# EAGLE schematic Bv Switch (EAGLE 6.2)
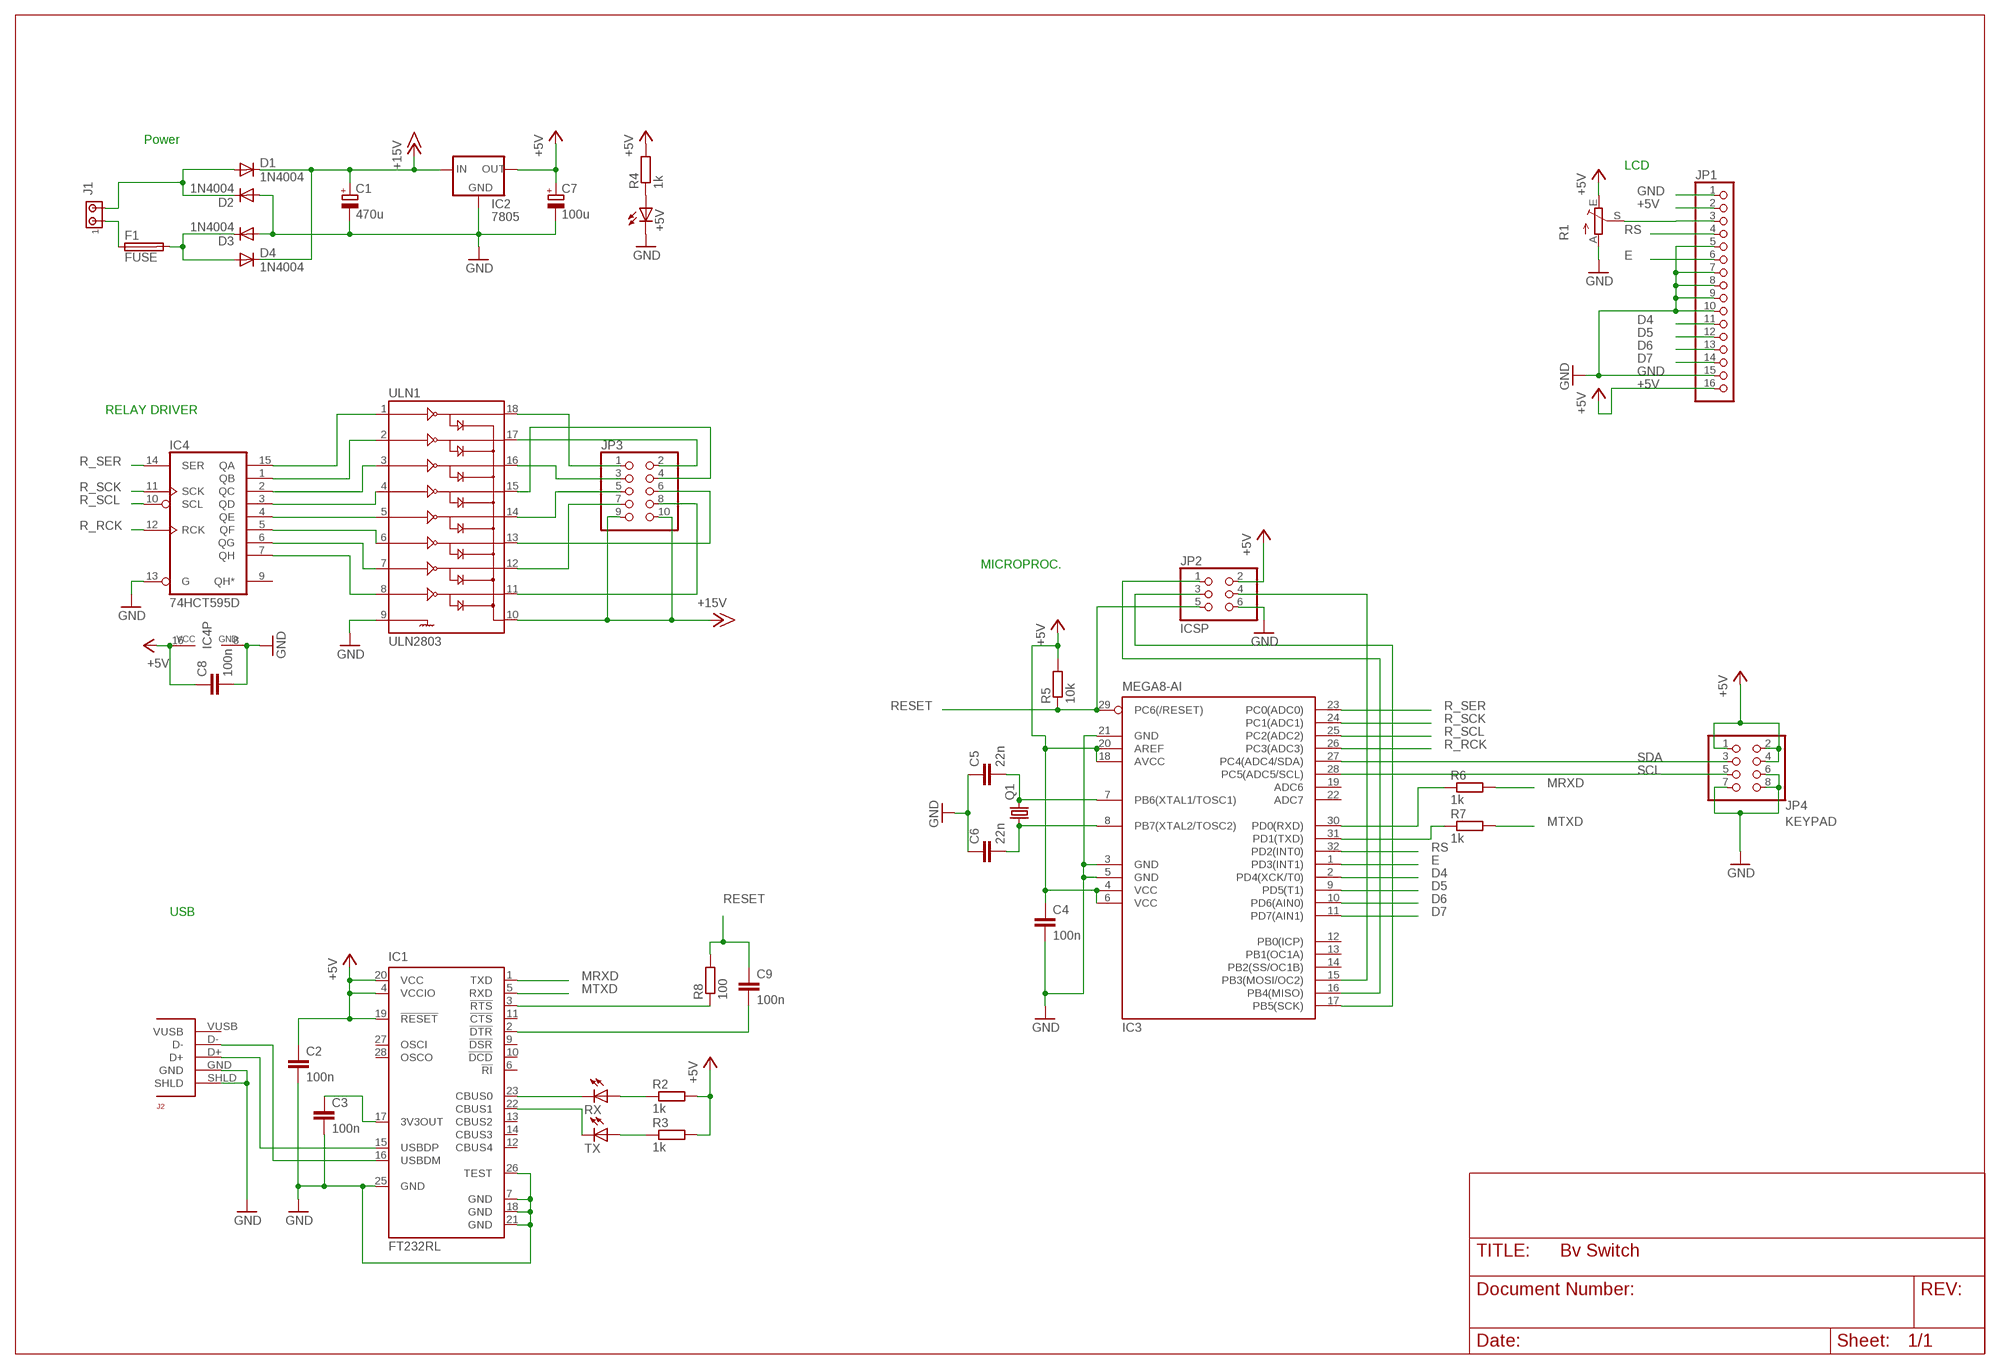
[diagram p0: schematic, sheet 1]

## Parts
+5V  LEDCHIPLED_1206  [CHIPLED_1206]
C1  470u  CPOL-EU153CLV-1010  [153CLV-1010]
C2  100n  C-EUC1206  [C1206]
C3  100n  C-EUC1206  [C1206]
C4  100n  C-EUC1206  [C1206]
C5  22n  C-EUC1206  [C1206]
C6  22n  C-EUC1206  [C1206]
C7  100u  CPOL-EU153CLV-1010  [153CLV-1010]
C8  100n  C-EUC1206  [C1206]
C9  100n  C-EUC1206  [C1206]
D1  1N4004  [DO41-10]
D2  1N4004  [DO41-10]
D3  1N4004  [DO41-10]
D4  1N4004  [DO41-10]
F1  FUSE  FUSEBLANK_5X20MM  [FUSE_HOLDER_5X20MM]
IC1  FT232RL  [SSOP28]
IC2  7805  78XXL  [78XXL]
IC3  MEGA8-AI  [TQFP32-08]
IC4  74HCT595D  [SO16]
J1  MTA02-156  [1X2MTA]
J2  USBHD  [PINHD4]
JP1  PINHD-1X16  [1X16]
JP2  ICSP  PINHD-2X3  [2X03]
JP3  PINHD-2X5  [2X05]
JP4  KEYPAD  PINHD-2X4  [2X04]
Q1  CRYSTALSM49  [SM49]
R1  TRIM_EU-CA6V  [CA6V]
R2  1k  R-EU_R1206  [R1206]
R3  1k  R-EU_R1206  [R1206]
R4  1k  R-EU_R1206  [R1206]
R5  10k  R-EU_R1206  [R1206]
R6  1k  R-EU_R1206  [R1206]
R7  1k  R-EU_R1206  [R1206]
R8  100  R-EU_R1206  [R1206]
RX  LEDCHIPLED_1206  [CHIPLED_1206]
TX  LEDCHIPLED_1206  [CHIPLED_1206]
ULN1  ULN2803  ULN2803SOIC  [SO018]

## Nets
+5V: C2.1 C4.1 C7.+ C8.1 IC1.4(VCCIO) IC1.19(!RESET) IC1.20(VCC) IC2.OUT IC3.4(VCC) IC3.6(VCC) IC3.18(AVCC) IC3.20(AREF) IC4.16(VCC) JP1.2 JP1.16 JP2.2 JP4.1 JP4.2 JP4.4 R1.E R2.2 R3.2 R4.2 R5.2
+15V [power]: C1.+ D1.C D4.C IC2.IN JP3.9 JP3.10 ULN1.10
D4: IC3.2(PD4(XCK/T0)) JP1.11
D5: IC3.9(PD5(T1)) JP1.12
D6: IC3.10(PD6(AIN0)) JP1.13
D7: IC3.11(PD7(AIN1)) JP1.14
E: IC3.1(PD3(INT1)) JP1.6
GND [gnd]: +5V.C C1.- C2.2 C3.2 C4.2 C5.1 C6.1 C7.- C8.2 D2.A D3.A IC1.7(GND) IC1.18(GND) IC1.21(GND) IC1.25(GND) IC1.26(TEST) IC2.GND IC3.3(GND) IC3.5(GND) IC3.21(GND) IC4.8(GND) IC4.13(G) J2.GND J2.SHLD JP1.1 JP1.5 JP1.7 JP1.8 JP1.9 JP1.10 JP1.15 JP2.6 JP4.6 JP4.7 JP4.8 R1.A ULN1.9
MRXD: IC1.1(TXD) R6.2
MTXD: IC1.5(RXD) R7.2
N$1 [power]: F1.1 J1.1
N$2 [power]: D3.C D4.A F1.2
N$3 [power]: D1.A D2.C J1.2
N$4: IC3.17(PB5(SCK)) JP2.3
N$5: IC1.15(USBDP) J2.D+
N$6: IC1.16(USBDM) J2.D-
N$7: +5V.A R4.1
N$8: C3.1 IC1.17(3V3OUT)
N$10: IC4.15(QA) ULN1.1
N$11: IC4.1(QB) ULN1.2
N$12: IC1.23(CBUS0) RX.C
N$13: IC1.22(CBUS1) TX.C
N$14: R2.1 RX.A
N$15: R3.1 TX.A
N$16: IC4.2(QC) ULN1.3
N$17: C5.2 IC3.7(PB6(XTAL1/TOSC1)) Q1.2
N$18: C6.2 IC3.8(PB7(XTAL2/TOSC2)) Q1.1
N$19: IC3.16(PB4(MISO)) JP2.1
N$20: IC4.3(QD) ULN1.4
N$21: IC3.15(PB3(MOSI/OC2)) JP2.4
N$22: IC3.30(PD0(RXD)) R6.1
N$23: IC3.31(PD1(TXD)) R7.1
N$24: IC4.4(QE) ULN1.5
N$25: IC4.5(QF) ULN1.6
N$26: IC4.6(QG) ULN1.7
N$27: IC4.7(QH) ULN1.8
N$28: JP3.1 ULN1.18
N$29: JP3.2 ULN1.17
N$30: JP3.3 ULN1.16
N$31: JP3.4 ULN1.15
N$32: JP3.5 ULN1.14
N$33: JP3.6 ULN1.13
N$34: JP3.7 ULN1.12
N$35: JP3.8 ULN1.11
N$36 [gnd]: C9.2 IC1.2(!DTR)
N$37 [gnd]: IC1.3(!RTS) R8.1
R_RCK: IC3.26(PC3(ADC3)) IC4.12(RCK)
R_SCK: IC3.24(PC1(ADC1)) IC4.11(SCK)
R_SCL: IC3.25(PC2(ADC2)) IC4.10(SCL)
R_SER: IC3.23(PC0(ADC0)) IC4.14(SER)
RESET: C9.1 IC3.29(PC6(/RESET)) JP2.5 R5.1 R8.2
RS: IC3.32(PD2(INT0)) JP1.4
SCL [gnd]: IC3.28(PC5(ADC5/SCL)) JP4.5
SDA [gnd]: IC3.27(PC4(ADC4/SDA)) JP4.3
VO: JP1.3 R1.S
Unconnected: IC1.6(!RI) IC1.9(!DSR) IC1.10(!DCD) IC1.11(!CTS) IC1.12(CBUS4) IC1.13(CBUS2) IC1.14(CBUS3) IC1.27(OSCI) IC1.28(OSCO) IC3.12(PB0(ICP)) IC3.13(PB1(OC1A)) IC3.14(PB2(SS/OC1B)) IC3.19(ADC6) IC3.22(ADC7) IC4.9(QH*) J2.VUSB

## Notes on the sheet
- Power
- LCD
- RELAY DRIVER
- MICROPROC.
- USB

## Library data of the parts
+5V RX TX = led:LED: LED OSRAM: - CHIPLED LG R971, LG N971, LY N971, LG Q971, LY Q971, LO R971, LY R971 LH N974, LH R974 LS Q976, LO Q976, LY Q976 LO Q996 - Hyper CHIPLED LW Q18S LB Q993, LB Q99A, LB R99A - SideLED LS A670, LO A670, LY A670, LG A670, LP A670 LB A673, LV A673, LT A673, LW A673 LH A674 LY A675 LS A676, LA A676, LO A676, LY A676, LW A676 LS A679, LY A679, LG A679 - Hyper Micro SIDELED® LS Y876, LA Y876, LO Y876, LY Y876 LT Y87S - SmartLED LW L88C, LW L88S LB L89C, LB L89S, LG L890 LS L89K, LO L89K, LY L89K LS L896, LA L896, LO L896, LY L896 - TOPLED LS T670, LO T670, LY T670, LG T670, LP T670 LSG T670, LSP T670, LSY T670, LOP T670, LYG T670 LG T671, LOG T671, LSG T671 LB T673, LV T673, LT T673, LW T673 LH T674 LS T676, LA T676, LO T676, LY T676, LB T676, LH T676, LSB T676, LW T676 LB T67C, LV T67C, LT T67C, LS T67K, LO T67K, LY T67K, LW E67C LS E67B, LA E67B, LO E67B, LY E67B, LB E67C, LV E67C, LT E67C LW T67C LS T679, LY T679, LG T679 LS T770, LO T770, LY T770, LG T770, LP T770 LB T773, LV T773, LT T773, LW T773 LH T774 LS E675, LA E675, LY E675, LS T675 LS T776, LA T776, LO T776, LY T776, LB T776 LHGB T686 LT T68C, LB T68C - Hyper Mini TOPLED® LB M676 - Mini TOPLED Santana® LG M470 LS M47K, LO M47K, LY M47K Source: http://www.osram.convergy.de LUXEON: - LUMILED® LXK2-PW12-R00, LXK2-PW12-S00, LXK2-PW14-U00, LXK2-PW14-V00 LXK2-PM12-R00, LXK2-PM12-S00, LXK2-PM14-U00 LXK2-PE12-Q00, LXK2-PE12-R00, LXK2-PE12-S00, LXK2-PE14-T00, LXK2-PE14-U00 LXK2-PB12-K00, LXK2-PB12-L00, LXK2-PB12-M00, LXK2-PB14-N00, LXK2-PB14-P00, LXK2-PB14-Q00 LXK2-PR12-L00, LXK2-PR12-M00, LXK2-PR14-Q00, LXK2-PR14-R00 LXK2-PD12-Q00, LXK2-PD12-R00, LXK2-PD12-S00 LXK2-PH12-R00, LXK2-PH12-S00 LXK2-PL12-P00, LXK2-PL12-Q00, LXK2-PL12-R00 Source: www.luxeon.com KINGBRIGHT: KA-3528ASYC Source: www.kingbright.com
C1 C7 = rcl:CPOL-EU: POLARIZED CAPACITOR, European symbol
C2-C6 C8 C9 = rcl:C-EU: CAPACITOR, European symbol
D1-D4 = diode:1N4004: DIODE general purpose rectifier, 1 A
F1 = fuse:FUSE: Fuse; OC_FARNELL: unknown; OC_NEWARK: unknown
IC1 = ftdichip:FT232R: Source: http://www.ftdichip.com/Documents/DataSheets/DS_FT232R_v104.pdf; MPN: FT232RL; OC_FARNELL: 1146032; OC_NEWARK: 91K9918
IC2 = v-reg:78XXL: VOLTAGE REGULATOR
IC3 = atmel:MEGA8: MICROCONTROLLER 8 Kbytes FLASH, 1 kbytes SRAM, 512 bytes EEPROM, USART, 6-channel 10 bit ADC, 2-channel 8 bit ADC Pin compatible with Atmega48, ATMega88, ATMega168 Source: avr.lbr; MPN: ATMEGA8-16AU; OC_FARNELL: 9171371; OC_NEWARK: 73M8863
IC4 = 74xx-eu:74*595: 8-bit SHIFT REGISTER, output latch
J1 = con-amp:MTA02-156: AMP connector
J2 = various:USBHD
JP1 = pinhead:PINHD-1X16: PIN HEADER
JP2 = pinhead:PINHD-2X3: PIN HEADER
JP3 = pinhead:PINHD-2X5: PIN HEADER
JP4 = pinhead:PINHD-2X4: PIN HEADER
Q1 = crystal:CRYSTAL: CRYSTAL; OC_FARNELL: unknown; OC_NEWARK: unknown
R1 = pot:TRIM_EU-: POTENTIOMETER
R2-R8 = rcl:R-EU_: RESISTOR, European symbol
ULN1 = SparkFun:ULN2803: Darlington Driver ULN2803 Darlington array. 500mA max per channel, 8-channel package. Spark Fun Electronics SKU : COM-00312

## Net classes
0 default: width 0.254 mm, drill 0.305 mm, clearance 0.152 mm
1 power: width 0.508 mm, drill 0.508 mm, clearance 0.152 mm
2 gnd: width 0.305 mm, drill 0.508 mm, clearance 0.152 mm
3 vusb: width 0.508 mm, drill 0.508 mm, clearance 0.152 mm